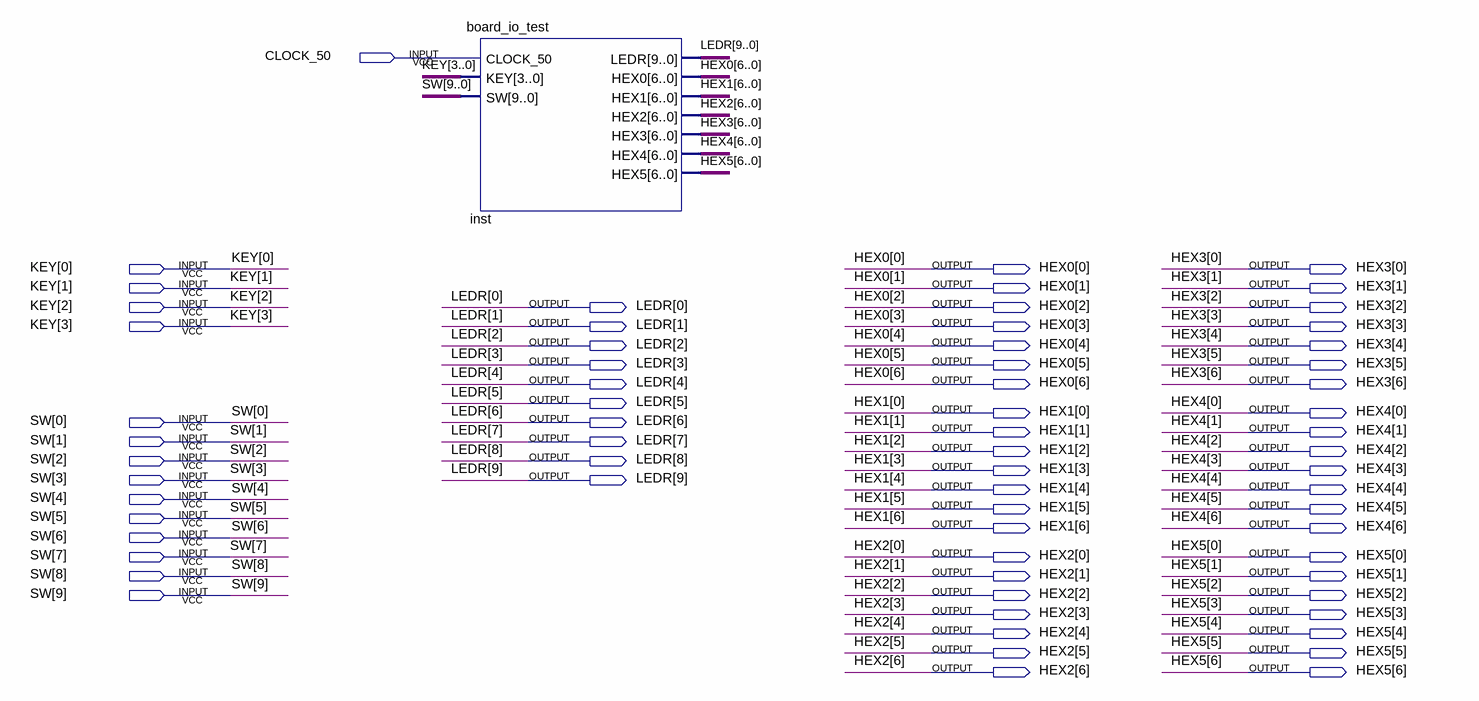
[diagram p0: schematic sheet]
// Quartus schematic schematic.bdf as structural Verilog: 1 symbols, 67 pins
module schematic (
  input  CLOCK_50,
  input  [3:0] KEY,
  input  [9:0] SW,
  output [6:0] HEX0,
  output [6:0] HEX3,
  output [9:0] LEDR,
  output [6:0] HEX1,
  output [6:0] HEX4,
  output [6:0] HEX2,
  output [6:0] HEX5
);

  board_io_test inst (
    .CLOCK_50(CLOCK_50), .KEY(KEY), .SW(SW), .LEDR(LEDR), .HEX0(HEX0), .HEX1(HEX1), .HEX2(HEX2), .HEX3(HEX3),
    .HEX4(HEX4), .HEX5(HEX5));
endmodule
